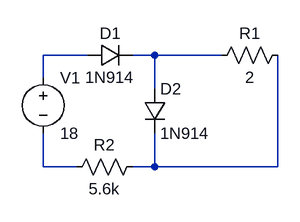
[diagram p0: schematic Draft1.asc]
Draft1.asc, the LTspice schematic file:
Version 4.1
SHEET 1 880 680
WIRE 80 80 16 80
WIRE 176 80 144 80
WIRE 272 80 176 80
WIRE 16 112 16 80
WIRE 176 128 176 80
WIRE 16 240 16 192
WIRE 64 240 16 240
WIRE 176 240 176 192
WIRE 176 240 144 240
WIRE 352 240 352 80
WIRE 352 240 176 240
SYMBOL voltage 16 96 R0
WINDOW 123 0 0 Left 0
WINDOW 39 0 0 Left 0
SYMATTR InstName V1
SYMATTR Value 18
SYMBOL diode 80 96 R270
WINDOW 0 32 32 VTop 2
WINDOW 3 0 32 VBottom 2
SYMATTR InstName D1
SYMATTR Value 1N914
SYMBOL diode 160 128 R0
SYMATTR InstName D2
SYMATTR Value 1N914
SYMBOL res 368 64 R90
WINDOW 0 0 56 VBottom 2
WINDOW 3 32 56 VTop 2
SYMATTR InstName R1
SYMATTR Value 2
SYMBOL res 160 224 R90
WINDOW 0 0 56 VBottom 2
WINDOW 3 32 56 VTop 2
SYMATTR InstName R2
SYMATTR Value 5.6k

The netlist it stands for:
* Draft1.asc
V1 N001 N003 18
D1 N001 N002 1N914
D2 N002 N004 1N914
R1 N004 N002 2
R2 N004 N003 5.6k
.model D D
.lib standard.dio
.backanno
.end